# EAGLE schematic Revision A (EAGLE 6.4)
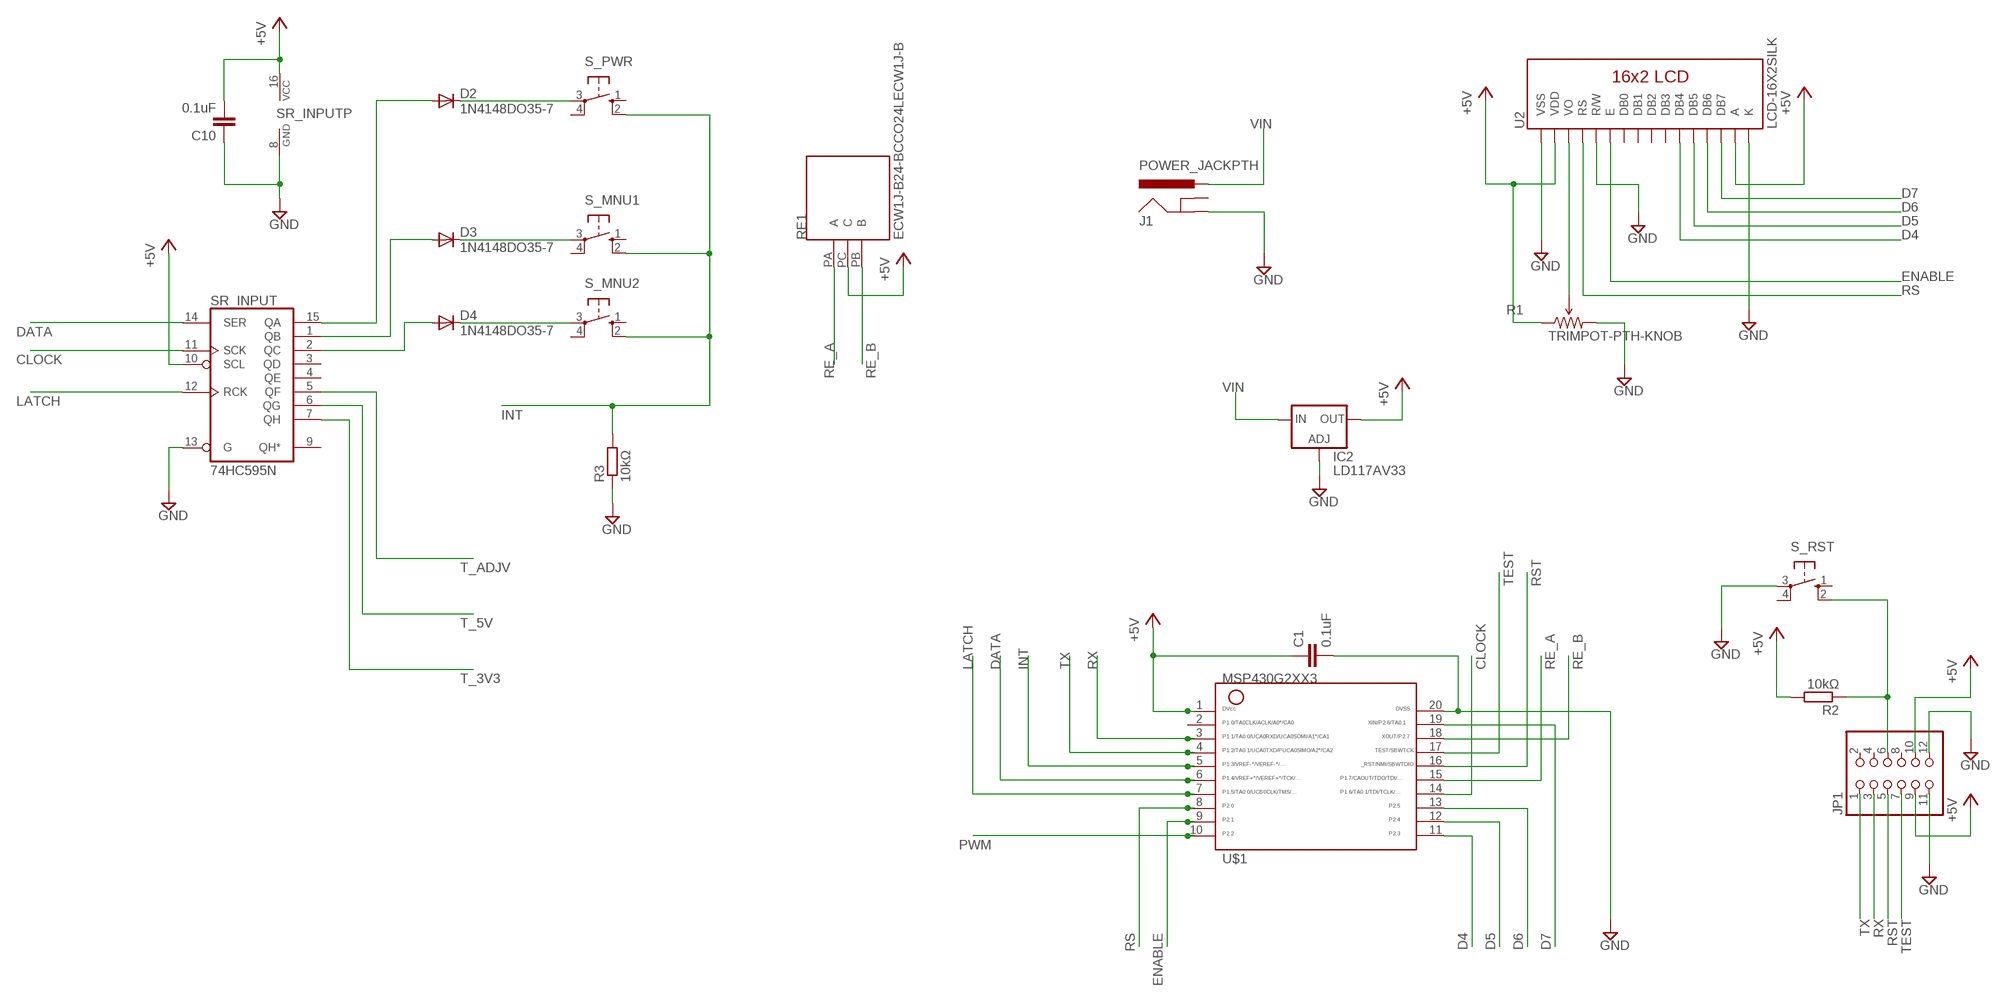
[diagram p0: schematic, sheet 1, part 1 of 2]
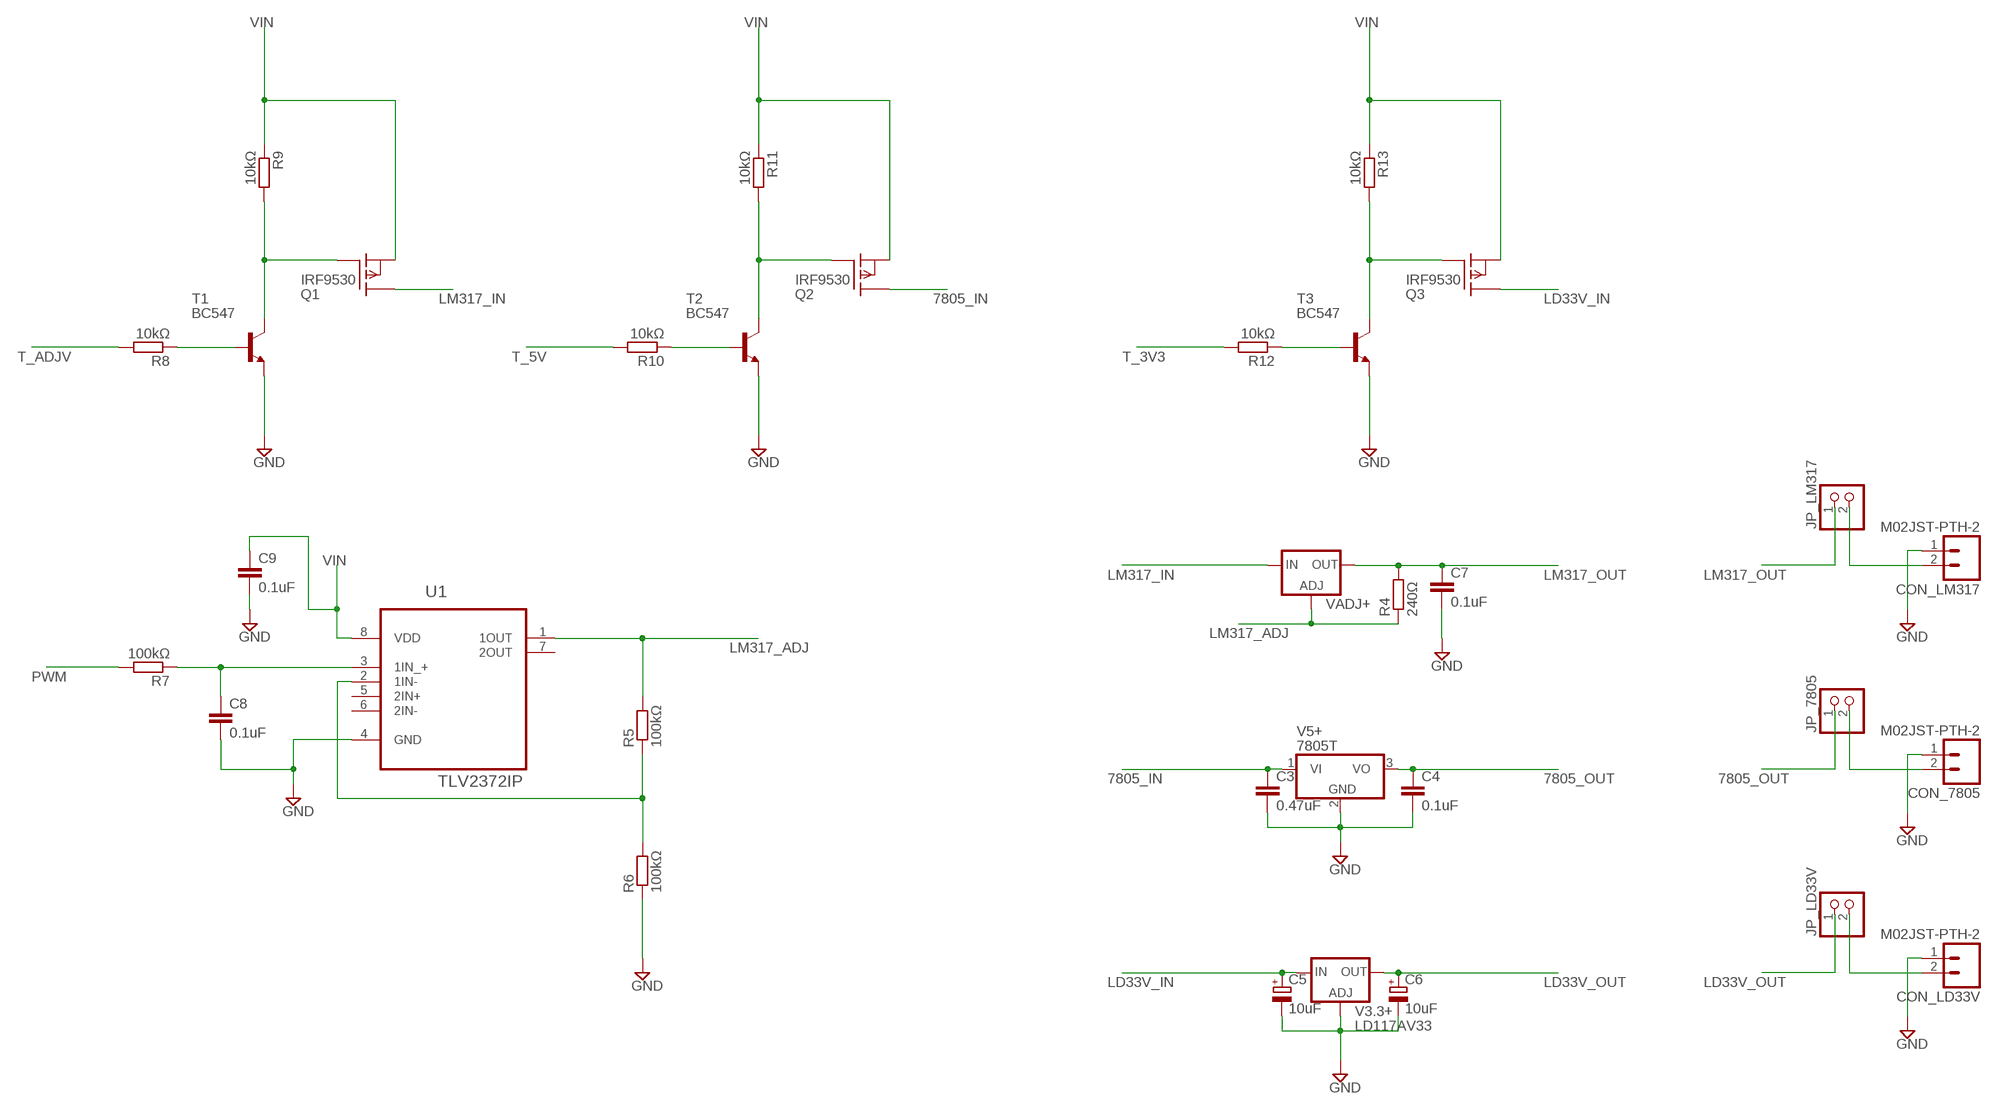
[diagram p1: schematic, sheet 1, part 2 of 2]

## Parts
C1  0.1uF  C-EU025-025X050  [C025-025X050]
C3  0.47uF  C-EU025-025X050  [C025-025X050]
C4  0.1uF  C-EU025-025X050  [C025-025X050]
C5  10uF  CPOL-EUE2.5-6  [E2,5-6]
C6  10uF  CPOL-EUE2.5-6  [E2,5-6]
C7  0.1uF  C-EU025-025X050  [C025-025X050]
C8  0.1uF  C-EU025-025X050  [C025-025X050]
C9  0.1uF  C-EU025-025X050  [C025-025X050]
C10  0.1uF  C-EU025-025X050  [C025-025X050]
CON_7805  M02JST-PTH-2  [JST-2-PTH]
CON_LD33V  M02JST-PTH-2  [JST-2-PTH]
CON_LM317  M02JST-PTH-2  [JST-2-PTH]
D2  1N4148DO35-7  [DO35-7]
D3  1N4148DO35-7  [DO35-7]
D4  1N4148DO35-7  [DO35-7]
IC2  LD117AV33  [TO220L1]
J1  POWER_JACKPTH  [POWER_JACK_PTH]
JP1  PINHD-2X6  [2X06]
JP_7805  PINHD-1X2  [1X02]
JP_LD33V  PINHD-1X2  [1X02]
JP_LM317  PINHD-1X2  [1X02]
Q1  IRF9530  [TO220]
Q2  IRF9530  [TO220]
Q3  IRF9530  [TO220]
R1  TRIMPOT-PTH-KNOB  [3386U]
R2  10kΩ  R-EU_0207/10  [0207/10]
R3  10kΩ  R-EU_0207/10  [0207/10]
R4  240Ω  R-EU_0207/10  [0207/10]
R5  100kΩ  R-EU_0207/10  [0207/10]
R6  100kΩ  R-EU_0207/10  [0207/10]
R7  100kΩ  R-EU_0207/10  [0207/10]
R8  10kΩ  R-EU_0207/10  [0207/10]
R9  10kΩ  R-EU_0207/10  [0207/10]
R10  10kΩ  R-EU_0207/10  [0207/10]
R11  10kΩ  R-EU_0207/10  [0207/10]
R12  10kΩ  R-EU_0207/10  [0207/10]
R13  10kΩ  R-EU_0207/10  [0207/10]
RE1  ECW1J-B24-BCCO24LECW1J-B  [ECW1J-B]
S_MNU1  10-XX  [B3F-10XX]
S_MNU2  10-XX  [B3F-10XX]
S_PWR  10-XX  [B3F-10XX]
S_RST  10-XX  [B3F-10XX]
SR_INPUT  74HC595N  [DIL16]
T1  BC547  [TO92]
T2  BC547  [TO92]
T3  BC547  [TO92]
U1  TLV2372IP  [DIP254P762X508-8]
U2  LCD-16X2SILK  [LCD-16X2]
U$1  G2XX3---N20  [N20]
V3.3+  LD117AV33  [TO220L1]
V5+  7805T  [TO220H]
VADJ+  LM317TL  [317TL]

## Nets
7805_IN: C3.1 Q2.2(D) V5+.1(VI)
7805_OUT: C4.1 JP_7805.1 V5+.3(VO)
+5V: C1.1 C10.2 IC2.2(OUT) JP1.9 JP1.10 R1.1(CCW) R2.2 RE1.PC(C) SR_INPUT.10(SCL) SR_INPUT.16(VCC) U2.2(VDD) U2.15(A) U$1.1
CLOCK: SR_INPUT.11(SCK) U$1.14
D4: U2.11(DB4) U$1.11
D5: U2.12(DB5) U$1.12
D6: U2.13(DB6) U$1.13
D7: U2.14(DB7) U$1.19
DATA: SR_INPUT.14(SER) U$1.6
ENABLE: U2.6(E) U$1.9
GND: C1.2 C3.2 C4.2 C5.- C6.- C7.2 C8.2 C9.2 C10.1 CON_7805.1 CON_LD33V.1 CON_LM317.1 IC2.1(ADJ) J1.GND JP1.11 JP1.12 R1.3(CW) R3.1 R6.1 S_RST.3(P) SR_INPUT.8(GND) SR_INPUT.13(G) T1.1(E) T2.1(E) T3.1(E) U1.4(GND) U2.1(VSS) U2.5(R/W) U2.16(K) U$1.20 V3.3+.1(ADJ) V5+.2(GND)
INT: R3.2 S_MNU1.2(S1) S_MNU2.2(S1) S_PWR.2(S1) U$1.5
LATCH: SR_INPUT.12(RCK) U$1.7
LD33V_IN: C5.+ Q3.2(D) V3.3+.3(IN)
LD33V_OUT: C6.+ JP_LD33V.1 V3.3+.2(OUT)
LM317_ADJ: R4.1 R5.2 U1.1(1OUT) VADJ+.1(ADJ)
LM317_IN: Q1.2(D) VADJ+.3(IN)
LM317_OUT: C7.1 JP_LM317.1 R4.2 VADJ+.2(OUT)
N$1: R1.2(WIPER) U2.3(VO)
N$2: D2.C S_PWR.3(P)
N$3: JP1.6 R2.1 S_RST.2(S1)
N$4: D3.C S_MNU1.3(P)
N$5: D4.C S_MNU2.3(P)
N$6: R5.1 R6.2 U1.2(1IN-)
N$7: C8.1 R7.1 U1.3(1IN_+)
N$8: R8.1 T1.2(B)
N$9: Q1.1(G) R9.2 T1.3(C)
N$10: R10.1 T2.2(B)
N$11: D3.A SR_INPUT.1(QB)
N$12: Q2.1(G) R11.2 T2.3(C)
N$13: R12.1 T3.2(B)
N$14: Q3.1(G) R13.2 T3.3(C)
N$15: CON_LM317.2 JP_LM317.2
N$16: D4.A SR_INPUT.2(QC)
N$17: D2.A SR_INPUT.15(QA)
N$18: CON_7805.2 JP_7805.2
N$19: CON_LD33V.2 JP_LD33V.2
PWM: R7.2 U$1.10
RE_A: RE1.PA(A) U$1.15
RE_B: RE1.PB(B) U$1.18
RS: U2.4(RS) U$1.8
RST: JP1.5 U$1.16
RX: JP1.3 U$1.3
T_3V3: R12.2 SR_INPUT.7(QH)
T_5V: R10.2 SR_INPUT.6(QG)
T_ADJV: R8.2 SR_INPUT.5(QF)
TEST: JP1.7 U$1.17
TX: JP1.1 U$1.4
VIN: C9.1 IC2.3(IN) J1.PWR Q1.3(S) Q2.3(S) Q3.3(S) R9.1 R11.1 R13.1 U1.8(VDD)
Unconnected: J1.GNDBREAK JP1.2 JP1.4 JP1.8 S_MNU1.1(S) S_MNU1.4(P1) S_MNU2.1(S) S_MNU2.4(P1) S_PWR.1(S) S_PWR.4(P1) S_RST.1(S) S_RST.4(P1) SR_INPUT.3(QD) SR_INPUT.4(QE) SR_INPUT.9(QH*) U1.5(2IN+) U1.6(2IN-) U1.7(2OUT) U2.7(DB0) U2.8(DB1) U2.9(DB2) U2.10(DB3) U$1.2

## Library data of the parts
C1 C3 C4 C7-C10 = rcl:C-EU: CAPACITOR, European symbol
C5 C6 = rcl:CPOL-EU: POLARIZED CAPACITOR, European symbol
CON_7805 CON_LD33V CON_LM317 = SparkFun-Connectors:M02: Standard 2-pin 0.1" header. Use with - straight break away headers ( PRT-00116) - right angle break away headers (PRT-00553) - swiss pins (PRT-00743) - machine pins (PRT-00117) - female headers (PRT-00115) Molex polarized connector foot print use with: PRT-08233 with associated crimp pins and housings. 2.54_SCREWTERM for use with PRT-10571. 3.5mm Screw Terminal footprints for PRT-08084 5mm Screw Terminal footprints for use with PRT-08433
D2-D4 = diode:1N4148: DIODE high speed (Philips)
IC2 V3.3+ = v-reg:LD117A?*: Low drop fixed and adjustable positive voltage regulators 1 A Source: http://www.st.com/stonline/products/literature/ds/7194/ld1117axx.pdf
J1 = SparkFun-Connectors:POWER_JACK: Power Jack This is the standard 5.5mm barrel jack for power. The PTH is the most common, proven, reliable, footprint. The Slot footprint only works if the mill layer is transmitted to the PCB fab house so be warned. Spark Fun Electronics SKU : PRT-00119 SMT: CONN-08106 Mating wall wart : TOL-00298 (and others)
JP1 = pinhead:PINHD-2X6: PIN HEADER
JP_7805 JP_LD33V JP_LM317 = pinhead:PINHD-1X2: PIN HEADER
Q1-Q3 = transistor-fet:IRF9530: P-Channel Enhancement MOSFET (HEXFET); -100V; -12A; 0,3Ohm
R1 = SparkFun-Electromechanical:TRIMPOT: Various small potentiometers for "set-and-forget" applications
R2-R13 = resistor:R-EU_: RESISTOR, European symbol
RE1 = Custom Stuff:ECW1J-B24-BCCO24L
S_MNU1 S_MNU2 S_PWR S_RST = switch-omron:10-XX: OMRON SWITCH; MPN: B3F-1000; OC_FARNELL: 176432; OC_NEWARK: 36M3542
SR_INPUT = 74xx-eu:74*595: 8-bit SHIFT REGISTER, output latch
T1-T3 = transistor:BC547: NPN TRANSISTOR
U1 = Texas Instruments_By_element14_Batch_1:TLV2372IP: OPERATIONAL AMPLIFIER; MPN: TLV2372IP; OC_FARNELL: 8455031; OC_NEWARK: 76C7976; PACKAGE: PDIP; SUPPLIER: Texas Instruments
U2 = SparkFun-Displays:LCD-16X2: Standard text-only 16x2 parallel input LCD
U$1 = TI_MSP430_v16:G2XX3---N20: MSP430G2XX1 PDIP (N) 20 Pin Package
V5+ = linear:78*: Positive VOLTAGE REGULATOR Source: http://cache.national.com/ds/LM/LM78L05.pdf http://www.fairchildsemi.com/ds/LM/LM7805.pdf
VADJ+ = v-reg:LM317TL: VOLTAGE REGULATOR